# Altium project placa.PrjPcb
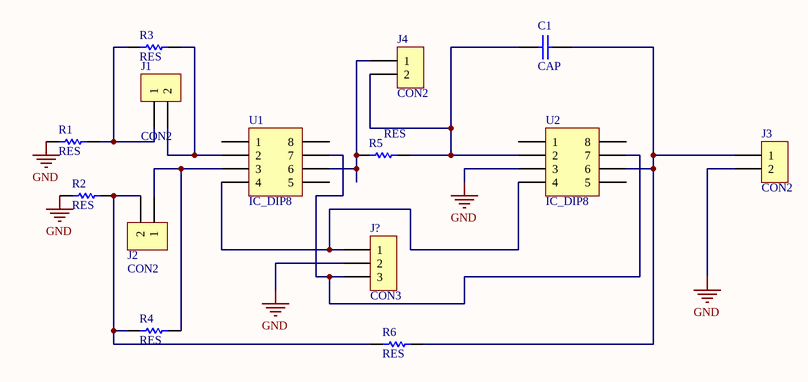
[diagram p0: esquematico.SchDoc]
1 sheet, 14 parts. Net scope: global (net labels, ports and power ports of the same name join across sheets).
Board file: PCB1.PcbDoc

## Sheet esquematico.SchDoc
size A4

### Parts
C1  CAP  [CAP200]
J1  CON2  [SIP2]
J2  CON2  [SIP2]
J3  CON2  [SIP2]
J4  CON2  [SIP2]
J?  CON3  [SIP3]
R1  RES  [RES400]
R2  RES  [RES400]
R3  RES  [RES400]
R4  RES  [RES400]
R5  RES  [RES400]
R6  RES  [RES400]
U1  IC_DIP8  [DIP8]
U2  IC_DIP8  [DIP8]

### Nets
GND: J3.2 J?.2 R1.1 R2.1 U2.3
NetC1_1: C1.1 J4.2 R5.2 U2.2
NetC1_2: C1.2 J3.1 R6.2 U2.6
NetJ1_1: J1.1 R1.2 R3.1
NetJ1_2: J1.2 R3.2 U1.2
NetJ2_1: J2.1 R4.2 U1.3
NetJ2_2: J2.2 R2.2 R4.1 R6.1
NetJ4_1: J4.1 R5.1 U1.6
NetJ?_1: J?.1 U1.4 U2.4
NetJ?_3: J?.3 U1.7 U2.7

Not connected (* = marked no-connect by the designer): U1 1 5 8; U2 1 5 8